# Altium project AutonomousVehicle_CurrentSense.PrjPcb
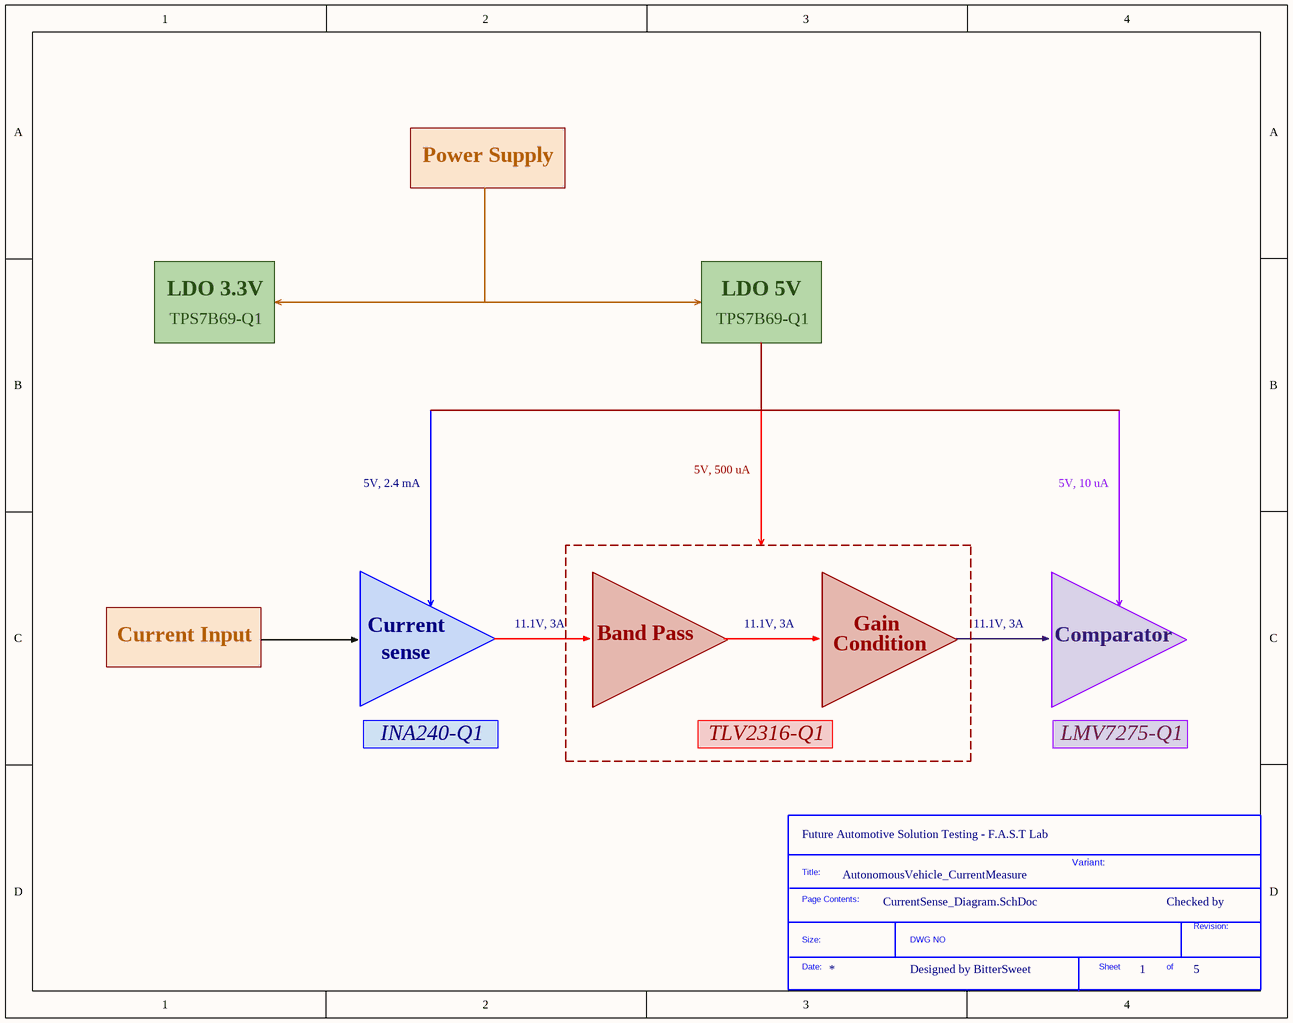
[diagram p0: CurrentSense_Diagram.SchDoc]
5 sheets, 72 parts. Net scope: flat (ports and power ports of the same name join across sheets).
Board file: AutonomousVehicle_CurrentSense.PcbDoc
Sheets:
  CurrentSense_Diagram.SchDoc
  CurrentSense_FileInfo.SchDoc
  CurrentSense_PowerDistribution.SchDoc
  CurrentSense_InputProcessing.SchDoc
  CurrentSense_ADCVoltage.SchDoc

## Sheet CurrentSense_Diagram.SchDoc
size A; SheetNumber: 1; SheetTotal: 5

### Parts
(Parts that share a designator on the sheet are numbered #1, #2 ... from top to bottom, then left to right.)
*?#1  SDTitleBlock  (value not drawn)  (graphical)

### Notes on the sheet
- Power Supply
- LDO 3.3V
- LDO 5V
- TPS7B69-Q1
- 5V, 2.4 mA
- 5V, 500 uA
- 5V, 10 uA
- Current
- 11.1V, 3A
- Band Pass
- Gain
- Current Input
- sense
- Condition
- Comparator
- INA240-Q1
- TLV2316-Q1
- LMV7275-Q1
- (near *?#1) Future Automotive Solution Testing - F.A.S.T Lab
- AutonomousVehicle_CurrentMeasure
- Variant:
- Checked by
- Designed by BitterSweet
- (in symbol SDTitleBlock) Title:; Page Contents:; Revision:; Size:; DWG NO; Date:; Sheet; of

## Sheet CurrentSense_FileInfo.SchDoc
size A; SheetNumber: 2; SheetTotal: 2

## Sheet CurrentSense_PowerDistribution.SchDoc
size A; SheetNumber: 3; SheetTotal: 5
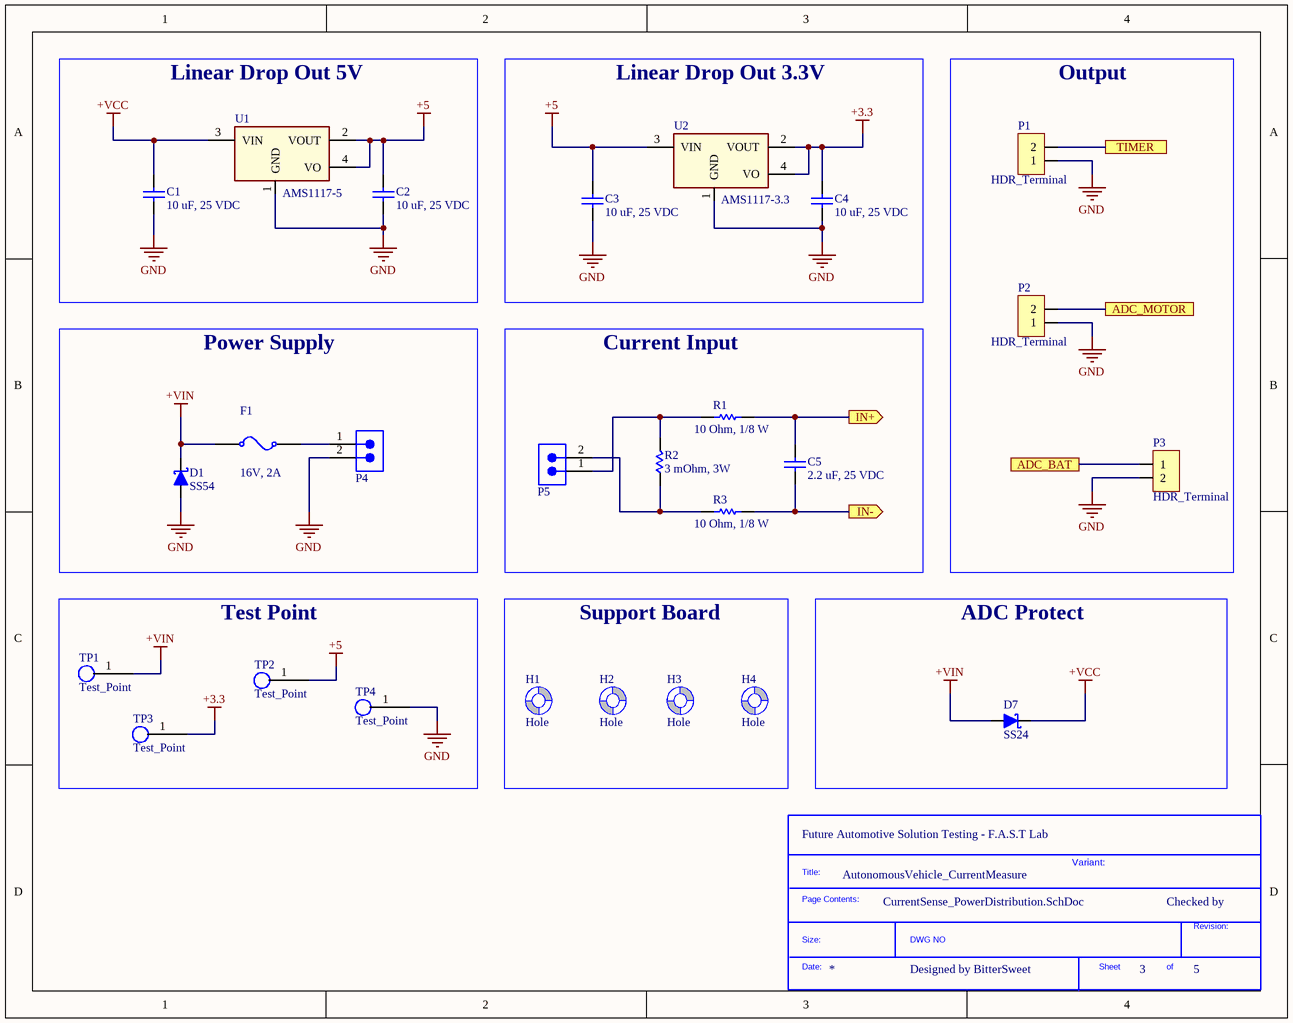
[diagram p1: CurrentSense_PowerDistribution.SchDoc]

### Parts
(Parts that share a designator on the sheet are numbered #1, #2 ... from top to bottom, then left to right.)
*?#2  SDTitleBlock  (value not drawn)  (graphical)
C1  10 uF, 25 VDC  [CAP_0603]
C2  10 uF, 25 VDC  [CAP_0603]
C3  10 uF, 25 VDC  [CAP_0603]
C4  10 uF, 25 VDC  [CAP_0603]
C5  2.2 uF, 25 VDC  [CAP_0805]
D1  SS54  [DO-214AB, SMA]
D7  SS24  [DO-214AB, SMA]
F1  16V, 2A  [Fuse_SMD_1812]
H1  Hole  [Hole_3.2mm]
H2  Hole  [Hole_3.2mm]
H3  Hole  [Hole_3.2mm]
H4  Hole  [Hole_3.2mm]
P1  HDR_Terminal  [HDR_Header_2.54]
P2  HDR_Terminal  [HDR_Header_2.54]
P3  HDR_Terminal  [HDR_Header_2.54]
P4  10A, 300V  [691322310002]  (value not drawn)
P5  10A, 300V  [691322310002]  (value not drawn)
R1  10 Ohm, 1/8 W  [RESISTOR_0805]
R2  3 mOhm, 3W  [RESISTOR-SMD-2512]
R3  10 Ohm, 1/8 W  [RESISTOR_0805]
TP1  Test_Point  [TP_1_5mm_SMD]
TP2  Test_Point  [TP_1_5mm_SMD]
TP3  Test_Point  [TP_1_5mm_SMD]
TP4  Test_Point  [TP_1_5mm_SMD]
U1  AMS1117-5  [AMS1117]
U2  AMS1117-3.3  [AMS1117]

### Blocks framed on the sheet
Linear Drop Out 5V: C1 C2 U1
Linear Drop Out 3.3V: C3 C4 U2
Output: P1-P3
Power Supply: D1 F1 P4
Current Input: C5 P5 R1-R3
Test Point: TP1-TP4
Support Board: H1-H4
ADC Protect: D7

### Ports
ADC_BAT, ADC_MOTOR, IN+ (out), IN- (out), TIMER

### Nets
+3.3: C4.2 TP3.1 U2.2(VOUT) U2.4(VO)
+5: C2.2 C3.2 TP2.1 U1.2(VOUT) U1.4(VO) U2.3(VIN)
+VCC: C1.2 D7.2(K) U1.3(VIN)
+VIN: D1.2(K) D7.1(A) F1.0 TP1.1
GND: C1.1 C2.1 C3.1 C4.1 D1.1(A) P1.1 P2.1 P3.2 P4.2 TP4.1 U1.1(GND) U2.1(GND)
NetC5_1: C5.1 R3.2 ; port IN-
NetC5_2: C5.2 R1.2 ; port IN+
NetC12_2: P1.2 ; port TIMER
NetC14_2: P2.2 ; port ADC_MOTOR
NetC15_2: P3.1 ; port ADC_BAT
NetF1_1: F1.1 P4.1
NetP5_1: P5.1 R1.1 R2.2
NetP5_2: P5.2 R2.1 R3.1

Not connected (* = marked no-connect by the designer): H1 1(Screw); H2 1(Screw); H3 1(Screw); H4 1(Screw)

### Notes on the sheet
- (near *?#2) Future Automotive Solution Testing - F.A.S.T Lab
- AutonomousVehicle_CurrentMeasure
- Variant:
- Checked by
- Designed by BitterSweet
- (in symbol SDTitleBlock) Title:; Page Contents:; Revision:; Size:; DWG NO; Date:; Sheet; of

### Library data of the parts
C1-C4 = 0106031061010: CAP, size 0603, 10 uF, 10 VDC; Manufacture Name: Samsung Electro-Mechanics; Manufacture SN: CL10A106KP8NNWC; Capacitance: 10 uF; Tolerance: +/-10%; Voltage Rating DC: 25 VDC; ComponentLink2Description: Datasheet; ComponentLink2URL: https://www.mouser.vn/datasheet/2/585/MLCC-1837944.pdf; Operating Temperature: -55 to +125degC; Packaging: Tape and Reel; Mounting Technology: SMT; Size: 0603; Supplier 1 Name: Mouser; Supplier 1 SN: 187-CL10A106KP8NNWC; Supplier 1 URL: https://www.mouser.vn/ProductDetail/Samsung-Electro-Mechanics/CL10A106KP8NNWC?qs=xZ%2FP%252Ba9zWqZx8LSX23YqWA%3D%3D&utm_source=mouser-refine-download&utm_medium=file&utm_campaign=CL10A106KP8NNWC&utm_content=Samsung-Electro-Mechanics; Supplier 2 Name: Digi-Key; Supplier 2 SN: 1276-CL10A106KP8NNWCTR-ND; Supplier 2 URL: https://www.digikey.com/en/products/detail/samsung-electro-mechanics/cl10a106kp8nnwc/16572907; Supplier 3 Name: thegioiic; Supplier 3 SN: N/A; Supplier 3 URL: https://www.thegioiic.com/tu-gom-0603-10uf-25v; Value: 10 uF, 25 VDC
C5 = 0108052251025: CAP, size 0805, 2.2 uF, 25 VDC; Manufacture Name: TDK; Manufacture SN: CGA4J3X7R1E225K125AD; Capacitance: 2.2 uF; Tolerance: +/-10%; Voltage Rating DC: 25 VDC; ComponentLink2Description: Datasheet; ComponentLink2URL: https://product.tdk.com/system/files/dam/doc/product/capacitor/ceramic/mlcc/catalog/mlcc_automotive_epoxy_en.pdf?ref_disty=mouser; Operating Temperature: -55 to +125degC; Packaging: Tape and Reel; Mounting Technology: SMT; Size: 0805; Supplier 1 Name: Mouser; Supplier 1 SN: 810-CGA4J3X7R1E225KD; Supplier 1 URL: https://www.mouser.vn/ProductDetail/TDK/CGA4J3X7R1E225K125AD?qs=xLDY6iXSiQZ6drRfaPQTzQ%3D%3D&utm_source=mouser-refine-download&utm_medium=file&utm_campaign=CGA4J3X7R1E225K125AD&utm_content=TDK; Supplier 2 Name: Digi-Key; Supplier 2 SN: 445-9923-2-ND; Supplier 2 URL: https://www.digikey.com/en/products/detail/tdk-corporation/cga4j3x7r1e225k125ad/3933656; Supplier 3 Name: thegioiic; Supplier 3 SN: OEM; Supplier 3 URL: https://www.thegioiic.com/tu-gom-0805-2-2uf-25v; Value: 2.2 uF, 25 VDC
D1 D7 = Diode_Schottky: SS54 SMC Diode Schottky 5A 40V
F1 = 061812200016: Resettable Fuse, Size 1812, 16V, 2A; Manufacturer: Littelfuse; Threshold Current: 40A; Trip Current: 4A; Threshold Voltage: 16V; Hold Current: 2A; Size: 1812; Mounting Technology: SMT/SMD; ComponentLink1Description: Datasheet link; ComponentLink1URL: https://www.littelfuse.com/~/media/electronics/product_specifications/resettable_ptcs/littelfuse_ptc_minismdc300f_2_product_specification.pdf.pdf; ComponentLink2Description: Supplier 1 URL; ComponentLink2URL: https://www.mouser.vn/ProductDetail/Littelfuse/MINISMDC200F-16-2?qs=pBN%2FbMTRZdcH0yqkqvkPxw%3D%3D; ComponentLink3Description: Supplier 2 URL; ComponentLink3URL: https://www.digikey.com/en/products/detail/littelfuse-inc/MINISMDC200F-16-2/6348163?s=N4IgTCBcDaILIEkByCDKcAiBhMAGXAYgPQCMAbALQQC6AvkA; ComponentLink4Description: Supplier 3 URL; ComponentLink4URL: https://www.thegioiic.com/cau-chi-tu-phuc-hoi-1812-16v-2a; Supplier 1 Name: Mouser; Supplier 1 SN: 650-MINISMDC200F/162; Supplier 1 URL: https://www.mouser.vn/ProductDetail/Littelfuse/MINISMDC200F-16-2?qs=pBN%2FbMTRZdcH0yqkqvkPxw%3D%3D; Supplier 2 Name: Digi-Key; Supplier 2 SN: MINISMDC200F/16-2TR-ND; Supplier 2 URL: https://www.mouser.vn/ProductDetail/Littelfuse/MINISMDC200F-16-2?qs=pBN%2FbMTRZdcH0yqkqvkPxw%3D%3D; Supplier 3 Name: thegioiic; Supplier 3 SN: N/A; Supplier 3 URL: https://www.thegioiic.com/cau-chi-tu-phuc-hoi-1812-16v-2a; Value: 16V, 2A
P1-P3 = HDR_Terminal: HDR_Terminal 2 pin; Supplier: ThegioiIC; ComponentLink1Description: URL; ComponentLink1URL: https://www.thegioiic.com/kf128-2-v-domino-2-chan-thang-3-5mm-300v-10a-han-pcb
P4 P5 = 691322310002: WR-TBL Series 322 Horizontal PCB Header, THT, pitch 3.81mm, 2p; Manufacturer: Wurth Elektronik; Modularity: No; ComponentLink1Description: Datasheet Link; ComponentLink1URL: https://www.we-online.com/redexpert/spec/691322310002?ad; ComponentLink2Description: Supplier 1 URL; ComponentLink2URL: N/A; Manufacturer Part Number: 691322310002; Category: Terminal Blocks; Match Code: WR-TBL; Mount: Through Hole; Operating Temperature Max: 105°C; Operating Temperature Min: -40°C; Packaging: Box; Application: Pluggable; Number of Pins: 2; Number of Rows: 1; Orientation: Horizontal; Pitch: 3.81mm; Rated Current: 10A; Working Voltage: 300V; ComponentLink3Description: Supplier 2 URL; ComponentLink3URL: N/A; ComponentLink4Description: Supplier 3 URL; ComponentLink4URL: https://www.thegioiic.com/kf-3-81-2-r-terminal-block-plug-in-han-pcb-2-chan-cong-3-81mm-300v-10a; Supplier 1 Name: Mouser; Supplier 1 SN: N/A; Supplier 1 URL: N/A; Supplier 2 Name: Digi-Key; Supplier 2 SN: N/A; Supplier 2 URL: N/A; Supplier 3 Name: thegioiic; Supplier 3 SN: N/A; Supplier 3 URL: https://www.thegioiic.com/kf-3-81-2-r-terminal-block-plug-in-han-pcb-2-chan-cong-3-81mm-300v-10a; Value: 10A, 300V
R1 R3 = 0008051001: RES, size 0805, 10 Ohm, 1/8 W; Manufacture  Name: Vishay Dale Thin Film; Manufacture  SN: M55342H06B10D0RT5; Resistance tolerance: +/-1%; Rated Power: 1/8 W; Resistance: 10 Ohm; Size: 0805; Mounting Technology: SMT; Supplier 1 Name: Mouser; Supplier 1 SN: 71-CRCW080510R0FKEAH; Supplier 1 URL: https://www.mouser.vn/ProductDetail/Vishay-Dale/CRCW080510R0FKEAHP?qs=sGAEpiMZZMtlubZbdhIBIB2QTI7Ai3Wq221SUXRDybo%3D; Supplier 2 Name: Digi-Key; Supplier 2 SN: 764-M55342H06B10D0RT5TR-ND; Supplier 2 URL: https://www.digikey.com/en/products/detail/vishay-dale-thin-film/M55342H06B10D0RT5/3580812; Supplier 3 Name: Thegioiic; Supplier 3 SN: N/A; Supplier 3 URL: https://www.thegioiic.com/dien-tro-10-ohm-0805-1-; Value: 10 Ohm, 1/8 W; ComponentLink1Description: Datasheet link; ComponentLink1URL: https://www.vishay.com/docs/60018/eh.pdf; ComponentLink2Description: Supplier 1 URL; ComponentLink2URL: https://www.mouser.vn/ProductDetail/Vishay-Dale/CRCW080510R0FKEAHP?qs=sGAEpiMZZMtlubZbdhIBIB2QTI7Ai3Wq221SUXRDybo%3D; ComponentLink3Description: Supplier 2 URL; ComponentLink3URL: https://www.digikey.com/en/products/detail/vishay-dale-thin-film/M55342H06B10D0RT5/3580812; ComponentLink4Description: Supplier 3 URL; ComponentLink4URL: https://www.thegioiic.com/dien-tro-10-ohm-0805-1-
R2 = RESISTOR: MP: NUCLEO-F401RE; Availability: Unavailable; Price: None; Package: None; Value: *; Mouser Link: https://www.mouser.vn/ProductDetail/Bourns/CRE2512-FZ-R003E-3?qs=rpfKl3ntHzPjkfGuk%252BIwsA%3D%3D&srsltid=AfmBOopEgYGycx6kmbnZ21OC9P-p9XnaYC4Ly7xv01NJ0SqXpV2qtA37; Mouser Part: 652-CRE2512FZR003E-3
U1 U2 = AMS1117: IC Linear Drop Out 3.3V 1A SOT-223
  U1: URL: https://www.thegioiic.com/xblw-ams1117-5-0v-ic-on-ap-5v-1a-sot-223
  U2: URL: https://www.thegioiic.com/ams1117-3-3v-ic-on-ap-3-3v-1a-sot-223

## Sheet CurrentSense_InputProcessing.SchDoc
size A; SheetNumber: 4; SheetTotal: 5
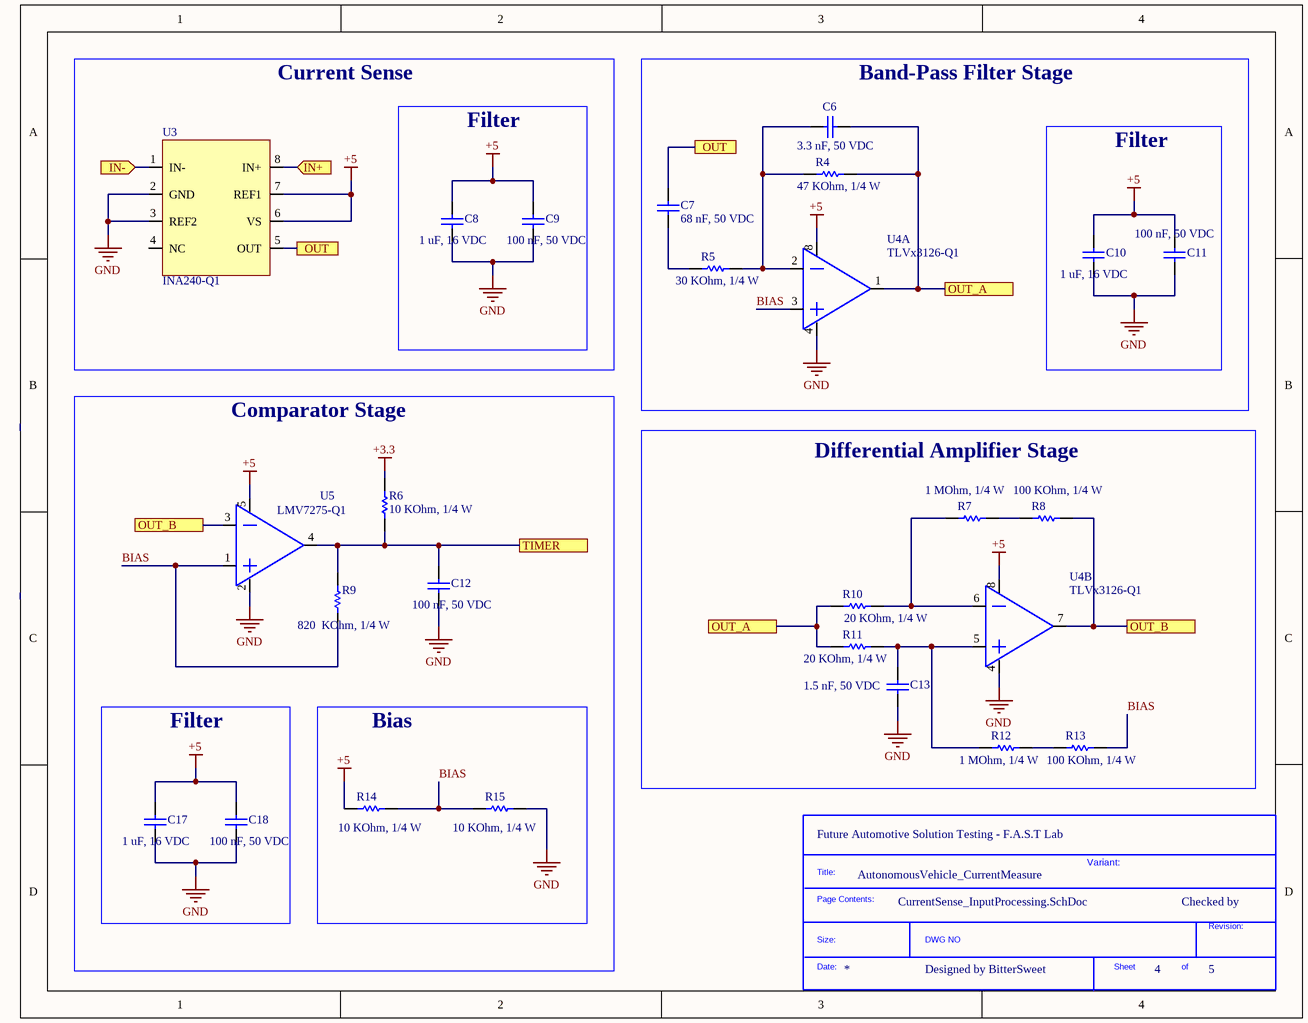
[diagram p2: CurrentSense_InputProcessing.SchDoc]

### Parts
(Parts that share a designator on the sheet are numbered #1, #2 ... from top to bottom, then left to right.)
*?#3  SDTitleBlock  (value not drawn)  (graphical)
C6  3.3 nF, 50 VDC  [CAP_0603]
C7  68 nF, 50 VDC  [CAP_0603]
C8  1 uF, 16 VDC  [CAP_0603]
C9  100 nF, 50 VDC  [CAP_0603]
C10  1 uF, 16 VDC  [CAP_0603]
C11  100 nF, 50 VDC  [CAP_0603]
C12  100 nF, 50 VDC  [CAP_0603]
C13  1.5 nF, 50 VDC  [CAP_0603]
C17  1 uF, 16 VDC  [CAP_0603]
C18  100 nF, 50 VDC  [CAP_0603]
R4  47 KOhm, 1/4 W  [resistor_0603]
R5  30 KOhm, 1/4 W  [resistor_0603]
R6  10 KOhm, 1/4 W  [resistor_0603]
R7  1 MOhm, 1/4 W  [resistor_0603]
R8  100 KOhm, 1/4 W  [resistor_0603]
R9  820  KOhm, 1/4 W  [resistor_0603]
R10  20 KOhm, 1/4 W  [resistor_0603]
R11  20 KOhm, 1/4 W  [resistor_0603]
R12  1 MOhm, 1/4 W  [resistor_0603]
R13  100 KOhm, 1/4 W  [resistor_0603]
R14  10 KOhm, 1/4 W  [resistor_0603]
R15  10 KOhm, 1/4 W  [resistor_0603]
U3  INA240-Q1  [INA240-Q1-SOIC-8]
U4  TLVx3126-Q1  [TLVx316-Q1-VSSOP8]  (parts A,B of 2)
U5  LMV7275-Q1  [LMV7275-Q1]

### Blocks framed on the sheet
Current Sense: U3
Band-Pass Filter Stage: C6 C7 R4 R5 U4
Filter: C8 C9
Filter: C10 C11
Comparator Stage: C12 R6 R9 U5
Differential Amplifier Stage: C13 R7 R8 R10-R13 U4
Filter: C17 C18
Bias: R14 R15

### Ports
IN+ (in), IN- (in), OUT, OUT_A, OUT_B, TIMER

### Nets
+3.3: R6.2
+5: C8.2 C9.2 C10.2 C11.2 C17.2 C18.2 R14.2 U3.6(VS) U3.7(REF1) U4.8(VCC) U5.5(V+)
GND: C8.1 C9.1 C10.1 C11.1 C12.1 C13.1 C17.1 C18.1 R15.1 U3.2(GND) U3.3(REF2) U4.4(GND) U5.2(V-)
BIAS: R9.1 R13.2 R14.1 R15.2 U4.3(INA+) U5.1(IN+)
NetC5_1: U3.1(IN-) ; port IN-
NetC5_2: U3.8(IN+) ; port IN+
NetC6_1: C6.1 R4.1 R5.2 U4.2(INA-)
NetC6_2: C6.2 R4.2 R10.1 R11.1 U4.1(OUTA) ; port OUT_A
NetC7_1: C7.1 R5.1
NetC7_2: C7.2 U3.5(OUT) ; port OUT
NetC12_2: C12.2 R6.1 R9.2 U5.4(OUT) ; port TIMER
NetC13_2: C13.2 R11.2 R12.1 U4.5(INB+)
NetP6_2: R8.2 U4.7(OUTB) U5.3(IN-) ; port OUT_B
NetR7_1: R7.1 R10.2 U4.6(INB-)
NetR7_2: R7.2 R8.1
NetR12_2: R12.2 R13.1

Not connected (* = marked no-connect by the designer): U3 4(NC)

### Notes on the sheet
- (near *?#3) Future Automotive Solution Testing - F.A.S.T Lab
- AutonomousVehicle_CurrentMeasure
- Variant:
- Checked by
- Designed by BitterSweet
- (in symbol SDTitleBlock) Title:; Page Contents:; Revision:; Size:; DWG NO; Date:; Sheet; of

### Library data of the parts
C6 = 0106033320550: CAP, size 0603, 3.3 nF, 50 VDC; Manufacture Name: TDK; Manufacture SN: CGA3E2C0G1H332J080AE; Capacitance: 3.3 nF; Tolerance: +/-5%; Voltage Rating DC: 50 VDC; ComponentLink2Description: Datasheet; ComponentLink2URL: https://product.tdk.com/system/files/dam/doc/product/capacitor/ceramic/mlcc/catalog/mlcc_automotive_soft_en.pdf?ref_disty=mouser; Operating Temperature: -55 to +125degC; Packaging: Tape and Reel; Mounting Technology: SMT; Size: 0603; Supplier 1 Name: Mouser; Supplier 1 SN: 810-CGA3E2C0G1H332J8; Supplier 1 URL: https://www.mouser.com/ProductDetail/TDK/CGA3E2C0G1H332J080AE?qs=P1JMDcb91o59%252BuVOytSHFw%3D%3D&utm_source=mouser-refine-download&utm_medium=file&utm_campaign=CGA3E2C0G1H332J080AE&utm_content=TDK; Supplier 2 Name: Digi-Key; Supplier 2 SN: 445-CGA3E2C0G1H332J080AETR-ND; Supplier 2 URL: https://www.digikey.com/en/products/detail/tdk-corporation/cga3e2c0g1h332j080ae/11697916; Supplier 3 Name: thegioiic; Supplier 3 SN: N/A; Supplier 3 URL: https://www.thegioiic.com/tu-gom-0603-3-3nf-50v; Value: 3.3 nF, 50 VDC
C7 = 0106036831050: CAP, size 0603, 68 nF, 50 VDC; Manufacture Name: TDK; Manufacture SN: CGA3E2X7R1H683K080AA; Capacitance: 68 nF; Tolerance: +/-10%; Voltage Rating DC: 50 VDC; ComponentLink2Description: Datasheet; ComponentLink2URL: https://product.tdk.com/system/files/dam/doc/product/capacitor/ceramic/mlcc/catalog/mlcc_automotive_general_en.pdf?ref_disty=mouser; Operating Temperature: -55 to +125degC; Packaging: Tape and Reel; Mounting Technology: SMT; Size: 0603; Supplier 1 Name: Mouser; Supplier 1 SN: 810-CGA3E2X7R1H683K; Supplier 1 URL: https://www.mouser.com/ProductDetail/TDK/CGA3E2X7R1H683K080AA?qs=NRhsANhppD%252BWyOHUcAY%252Bxg%3D%3D&utm_source=mouser-refine-download&utm_medium=file&utm_campaign=CGA3E2X7R1H683K080AA&utm_content=TDK; Supplier 2 Name: Digi-Key; Supplier 2 SN: 445-5665-2-ND; Supplier 2 URL: https://www.digikey.com/en/products/detail/tdk-corporation/cga3e2x7r1h683k080aa/2443143; Supplier 3 Name: thegioiic; Supplier 3 SN: N/A; Supplier 3 URL: https://www.thegioiic.com/tu-gom-0603-68nf-50v; Value: 68 nF, 50 VDC
C8 C10 C17 = 0106031051016: CAP, size 0603, 1 uF, 16 VDC; Manufacture Name: Samsung Electro-Mechanics; Manufacture SN: CL10B105KO8NNWC; Capacitance: 1 uF; Tolerance: +/-10%; Voltage Rating DC: 16 VDC; ComponentLink2Description: Datasheet; ComponentLink2URL: https://www.mouser.vn/datasheet/2/585/Samsung_MLCC_1837944-1929650.pdf; Operating Temperature: -55 to +125degC; Packaging: Tape and Reel; Mounting Technology: SMT; Size: 0603; Supplier 1 Name: Mouser; Supplier 1 SN: 187-CL10B105KO8NNWC; Supplier 1 URL: https://www.mouser.vn/ProductDetail/Samsung-Electro-Mechanics/CL10B105KO8NNWC?qs=81r%252BiQLm7BT%252BXtc72qn1ug%3D%3D&utm_source=mouser-refine-download&utm_medium=file&utm_campaign=CL10B105KO8NNWC&utm_content=Samsung-Electro-Mechanics; Supplier 2 Name: Digi-Key; Supplier 2 SN: 1276-CL10B105KO8NNWCTR-ND; Supplier 2 URL: https://www.digikey.com/en/products/detail/samsung-electro-mechanics/cl10b105ko8nnwc/16572783; Supplier 3 Name: thegioiic; Supplier 3 SN: N/A; Supplier 3 URL: https://www.thegioiic.com/tu-gom-0603-1uf-16v; Value: 1 uF, 16 VDC
C9 C11 C12 C18 = 0106031041050: CAP, size 0603, 100 nF, 50 VDC; Manufacture Name: TDK; Manufacture SN: CGA3E3X8R1H104K080AE; Capacitance: 100 nF; Tolerance: +/-10%; Voltage Rating DC: 50 VDC; ComponentLink2Description: Datasheet; ComponentLink2URL: https://product.tdk.com/system/files/dam/doc/product/capacitor/ceramic/mlcc/catalog/mlcc_automotive_soft_en.pdf?ref_disty=mouser; Operating Temperature: -55 to +125degC; Packaging: Tape and Reel; Mounting Technology: SMT; Size: 0603; Supplier 1 Name: Mouser; Supplier 1 SN: 810-CGA3E3X8R1H104KA; Supplier 1 URL: https://www.mouser.com/ProductDetail/TDK/CGA3E3X8R1H104K080AE?qs=nQSIdc08i%252Bd8g3IRRgU2bw%3D%3D&utm_source=mouser-refine-download&utm_medium=file&utm_campaign=CGA3E3X8R1H104K080AE&utm_content=TDK; Supplier 2 Name: Digi-Key; Supplier 2 SN: 445-173697-2-ND; Supplier 2 URL: https://www.digikey.com/en/products/detail/tdk-corporation/cga3e3x8r1h104k080ae/5809262; Supplier 3 Name: thegioiic; Supplier 3 SN: N/A; Supplier 3 URL: N/Ahttps://www.thegioiic.com/tu-gom-0603-100nf-0-1uf-50v; Value: 100 nF, 50 VDC
C13 = 0106031521050: CAP, size 0603, 1.5 nF, 50 VDC; Manufacture Name: TDK; Manufacture SN: CGA3E2X7R1H152K080AA; Capacitance: 1.5 nF; Tolerance: +/-10%; Voltage Rating DC: 50 VDC; ComponentLink2Description: Datasheet; ComponentLink2URL: https://product.tdk.com/system/files/dam/doc/product/capacitor/ceramic/mlcc/catalog/mlcc_automotive_general_en.pdf?ref_disty=mouser; Operating Temperature: -55 to +125degC; Packaging: Tape and Reel; Mounting Technology: SMT; Size: 0603; Supplier 1 Name: Mouser; Supplier 1 SN: 810-CGA3E2X7R1H152K; Supplier 1 URL: https://www.mouser.com/ProductDetail/TDK/CGA3E2X7R1H152K080AA?qs=NRhsANhppD%2FNdlvuo0XOnQ%3D%3D&utm_source=mouser-refine-download&utm_medium=file&utm_campaign=CGA3E2X7R1H152K080AA&utm_content=TDK; Supplier 2 Name: Digi-Key; Supplier 2 SN: 445-6920-2-ND; Supplier 2 URL: https://www.digikey.com/en/products/detail/tdk-corporation/cga3e2x7r1h152k080aa/2672813; Supplier 3 Name: thegioiic; Supplier 3 SN: N/A; Supplier 3 URL: https://www.thegioiic.com/tu-gom-0603-1-5nf-50v; Value: 1.5 nF, 50 VDC
R4 = 0006034701: RES, size 0603, 47 Ohm, 1/4 W; Manufacture  Name: OEM; Rated Power: 1/4 W; Resistance: 47 KOhm; Resistance Tolerance: +/-1%; Size: 0603; Mounting Technology: SMT; Supplier 1 Name: Mouser; Supplier 1 SN: 667-ERJ-UP3F47R0V; Supplier 1 URL: https://www.mouser.vn/ProductDetail/Panasonic/ERJ-UP3F47R0V?qs=GedFDFLaBXE9d1Rnv%2Fokmg%3D%3D; Supplier 2 Name: Digi-Key; Supplier 2 SN: 10-ERJ-UP3F47R0VTR-ND - Tape & Reel (TR); Supplier 3 Name: thegioiic; Supplier 3 SN: N/A; Supplier 3 URL: https://www.thegioiic.com/dien-tro-47-kohm-0603-1-; Manufacture  SN: OEM; Value: 47 KOhm, 1/4 W; ComponentLink1Description: Datasheet link; ComponentLink1URL: https://www.mouser.vn/datasheet/2/315/Panasonic_Resistors_Thick_Film_Anti_Sulf_Anti_Surg-1825099.pdf; ComponentLink2Description: Supplier 1 URL; ComponentLink2URL: N/A; ComponentLink3Description: Supplier 2 URL; ComponentLink3URL: https://www.digikey.com/en/products/detail/panasonic-electronic-components/ERJ-UP3F47R0V/12092512?s=N4IgTCBcDaIGxwOwFoCiAlAUsgqgBQGYAxAFkXQAYA1EAXQF8g; ComponentLink4Description: Supplier 3 URL; ComponentLink4URL: N/A; Supplier 2 URL: https://www.digikey.com/en/products/detail/panasonic-electronic-components/ERJ-UP3F47R0V/12092512?s=N4IgTCBcDaIGxwOwFoCiAlAUsgqgBQGYAxAFkXQAYA1EAXQF8g
R5 = 0006032345: RES, size 0603, 230 KOhm, 1/4 W; Manufacture  Name: OEM; Rated Power: 1/4 W; Resistance Tolerance: +/-1%; Size: 0603; Mounting Technology: SMT; Resistance: 230 KOhm; Supplier 1 Name: Mouser; Supplier 1 SN: N/A; Supplier 1 URL: N/A; Supplier 2 Name: Digi-Key; Supplier 2 SN: N/A; Supplier 3 Name: thegioiic; Supplier 3 SN: N/A; Supplier 3 URL: https://www.thegioiic.com/dien-tro-30-kohm-0603-1-; Manufacture  SN: OEM; Value: 30 KOhm, 1/4 W; ComponentLink1Description: Datasheet link; ComponentLink1URL: N/A; ComponentLink2Description: Supplier 1 URL; ComponentLink2URL: N/A; ComponentLink3Description: Supplier 2 URL; ComponentLink3URL: N/A; ComponentLink4Description: Supplier 3 URL; ComponentLink4URL: N/A; Supplier 2 URL: N/A
R6 R14 R15 = 0006031031: RES, size 0603, 10 KOhm, 1/4 W; Manufacture  Name: OEM; Resistance: 10 KOhm; Rated Power: 1/4 W; Resistance Tolerance: +/-1%; Size: 0603; Mounting Technology: SMT; Supplier 1 Name: Mouser; Supplier 1 SN: 755-ESR03EZPF1002; Supplier 2 Name: Digi-Key; Supplier 2 SN: RHM10KADTR-ND RHM10KADCT-ND RHM10KADDKR-ND; Supplier 1 URL: https://www.mouser.vn/ProductDetail/ROHM-Semiconductor/ESR03EZPF1002?qs=sGAEpiMZZMvdGkrng054t67Efho1F8r6CDeAsqwFse8%3D; Supplier 3 Name: thegioiic; Supplier 3 SN: N/A; Supplier 3 URL: https://www.thegioiic.com/dien-tro-10-kohm-0603-1-; Manufacture  SN: OEM; Value: 10 KOhm, 1/4 W; ComponentLink1Description: Datasheet link; ComponentLink1URL: https://fscdn.rohm.com/en/products/databook/datasheet/passive/resistor/chip_resistor/esr-e.pdf; ComponentLink2Description: Supplier 1 URL; ComponentLink2URL: N/A; ComponentLink3Description: Supplier 2 URL; ComponentLink3URL: https://www.digikey.com/en/products/detail/rohm-semiconductor/ESR03EZPF1002/1983429; ComponentLink4Description: Supplier 3 URL; ComponentLink4URL: N/A; Supplier 2 URL: https://www.digikey.com/en/products/detail/rohm-semiconductor/ESR03EZPF1002/1983429
R7 R12 = 0006031051: RES, size 0603, 1 MOhm, 1/4 W; Manufacture  Name: OEM; Resistance: 1 MOhm; Rated Power: 1/4 W; Resistance Tolerance: +/-1%; Size: 0603; Mounting Technology: SMT; Supplier 1 Name: Mouser; Supplier 1 SN: 71-RCS06031M00FKEA; Supplier 2 Name: Digi-Key; Supplier 2 SN: 541-2803-2-ND 541-2803-1-ND 541-2803-6-ND; Supplier 1 URL: https://www.mouser.vn/ProductDetail/Vishay-Dale/RCS06031M00FKEA?qs=sGAEpiMZZMvdGkrng054t9clqp6gtJJdWojIF5doOmwdMUlAJJ6Dlw%3D%3D; Supplier 3 Name: thegioiic; Supplier 3 SN: N/A; Supplier 3 URL: https://www.thegioiic.com/dien-tro-1-mohm-0603-1-; Manufacture  SN: OEM; Value: 1 MOhm, 1/4 W; ComponentLink1Description: Datasheet link; ComponentLink1URL: https://www.vishay.com/docs/20065/rcse3.pdf; ComponentLink2Description: Supplier 1 URL; ComponentLink2URL: N/A; ComponentLink3Description: Supplier 2 URL; ComponentLink3URL: https://www.digikey.com/en/products/detail/vishay-dale/RCS06031M00FKEA/5866949; ComponentLink4Description: Supplier 3 URL; ComponentLink4URL: N/A; Supplier 2 URL: https://www.digikey.com/en/products/detail/vishay-dale/RCS06031M00FKEA/5866949
R8 R13 = 0006031041: RES, size 0603, 100 KOhm, 1/4 W; Manufacture  Name: OEM; Rated Power: 1/4 W; Resistance Tolerance: +/-1%; Resistance: 100 KOhm; Size: 0603; Mounting Technology: SMT; Supplier 1 Name: Mouser; Supplier 1 SN: 603-SR0603FR-7T100KL; Supplier 2 Name: Digi-Key; Supplier 2 SN: YAG5821TR-ND YAG5821CT-ND YAG5821DKR-ND; Supplier 1 URL: https://www.mouser.vn/ProductDetail/YAGEO/SR0603FR-7T100KL?qs=sGAEpiMZZMvdGkrng054tz1y1XEHv7sNa%252BA%2F4WiDMf7aGw4zRBb%2FFQ%3D%3D; Supplier 3 Name: thegioiic; Supplier 3 SN: N/A; Supplier 3 URL: https://www.thegioiic.com/dien-tro-100-kohm-0603-1-; Manufacture  SN: OEM; Value: 100 KOhm, 1/4 W; ComponentLink1Description: Datasheet link; ComponentLink1URL: https://www.yageo.com/upload/media/product/productsearch/datasheet/rchip/PYu-SR_20105_RoHS_L_10.pdf; ComponentLink2Description: Supplier 1 URL; ComponentLink2URL: N/A; ComponentLink3Description: Supplier 2 URL; ComponentLink3URL: https://www.digikey.com/en/products/detail/yageo/SR0603FR-7T100KL/9373095; ComponentLink4Description: Supplier 3 URL; ComponentLink4URL: N/A; Supplier 2 URL: https://www.digikey.com/en/products/detail/yageo/SR0603FR-7T100KL/9373095
R9 = 0006038251: RES, size 0603, 820  KOhm, 1/4 W; Manufacture  Name: OEM; Rated Power: 1/4 W; Resistance Tolerance: +/-1%; Size: 0603; Mounting Technology: SMT; Resistance: 820  KOhm; Supplier 1 Name: Mouser; Supplier 1 SN: 660-HV731JTTD8204F; Supplier 1 URL: https://www.mouser.vn/ProductDetail/KOA-Speer/HV731JTTD8204F?qs=ZqVPfSd1khqN0teaqWW7DA%3D%3D; Supplier 2 Name: Digi-Key; Supplier 2 SN: 13-RC0603FR-078M2LTR-ND; Supplier 3 Name: thegioiic; Supplier 3 SN: N/A; Supplier 3 URL: https://www.thegioiic.com/product/dien-tro-dan-smd?prid=6628,4725; Manufacture  SN: OEM; Value: 820  KOhm, 1/4 W; ComponentLink1Description: Datasheet link; ComponentLink1URL: N/A; ComponentLink2Description: Supplier 1 URL; ComponentLink2URL: N/A; ComponentLink3Description: Supplier 2 URL; ComponentLink3URL: https://www.digikey.com/en/products/detail/yageo/RC0603FR-078M2L/5918418; ComponentLink4Description: Supplier 3 URL; ComponentLink4URL: N/A; Supplier 2 URL: https://www.digikey.com/en/products/detail/yageo/RC0603FR-078M2L/5918418
R10 R11 = 0006032035: RES, size 0603, 20 KOhm, 1/4 W; Manufacture  Name: Panasonic; Manufacture  SN: ERJ-UP3J203V; Rated Power: 1/4 W; Resistance: 20 KOhm; Resistance Tolerance: +/-5%; Size: 0603; Mounting Technology: SMT; Supplier 1 Name: Mouser; Supplier 1 SN: 667-ERJ-UP3J203V; Supplier 1 URL: https://www.mouser.vn/datasheet/2/315/Panasonic_Resistors_Thick_Film_Anti_Sulf_Anti_Surg-1825099.pdf; Supplier 2 Name: Digi-Key; Supplier 2 SN: 10-ERJ-UP3J203VTR-ND - Tape & Reel (TR); Supplier 3 Name: thegioiic; Supplier 3 SN: N/A; Supplier 3 URL: https://www.thegioiic.com/dien-tro-20-kohm-0603-1-; Value: 20 KOhm, 1/4 W; ComponentLink1Description: Datasheet link; ComponentLink1URL: https://www.mouser.vn/datasheet/2/315/Panasonic_Resistors_Thick_Film_Anti_Sulf_Anti_Surg-1825099.pdf; ComponentLink2Description: Supplier 1 URL; ComponentLink2URL: N/A; ComponentLink3Description: Supplier 2 URL; ComponentLink3URL: https://www.digikey.com/en/products/detail/panasonic-electronic-components/ERJ-UP3J203V/12092736?s=N4IgTCBcDaIGxwOwFoCiAlAUsgqgBQGZMwAGAgNRAF0BfIA; ComponentLink4Description: Supplier 3 URL; ComponentLink4URL: N/A; Supplier 2 URL: https://www.digikey.com/en/products/detail/panasonic-electronic-components/ERJ-UP3J203V/12092736?s=N4IgTCBcDaIGxwOwFoCiAlAUsgqgBQGZMwAGAgNRAF0BfIA
U3 = INA240-Q1: INA240-Q1 AEC-Q100, –4-V to 80-V, Bidirectional, Ultra-Precise Current Sense Amplifier With Enhanced PWM Rejection
U4 = TLVx3126-Q1: TLVx316-Q1 10-MHz, Rail-to-Rail Input/Output, Low-Voltage, 1.8-V CMOS Operational Amplifiers
U5 = LMV7275-Q1: LMV7275-Q1 Automotive Single 1.8-V Low Power Comparator With Rail-to-Rail Input. SC-70 package.

## Sheet CurrentSense_ADCVoltage.SchDoc
size A; SheetNumber: 5; SheetTotal: 5
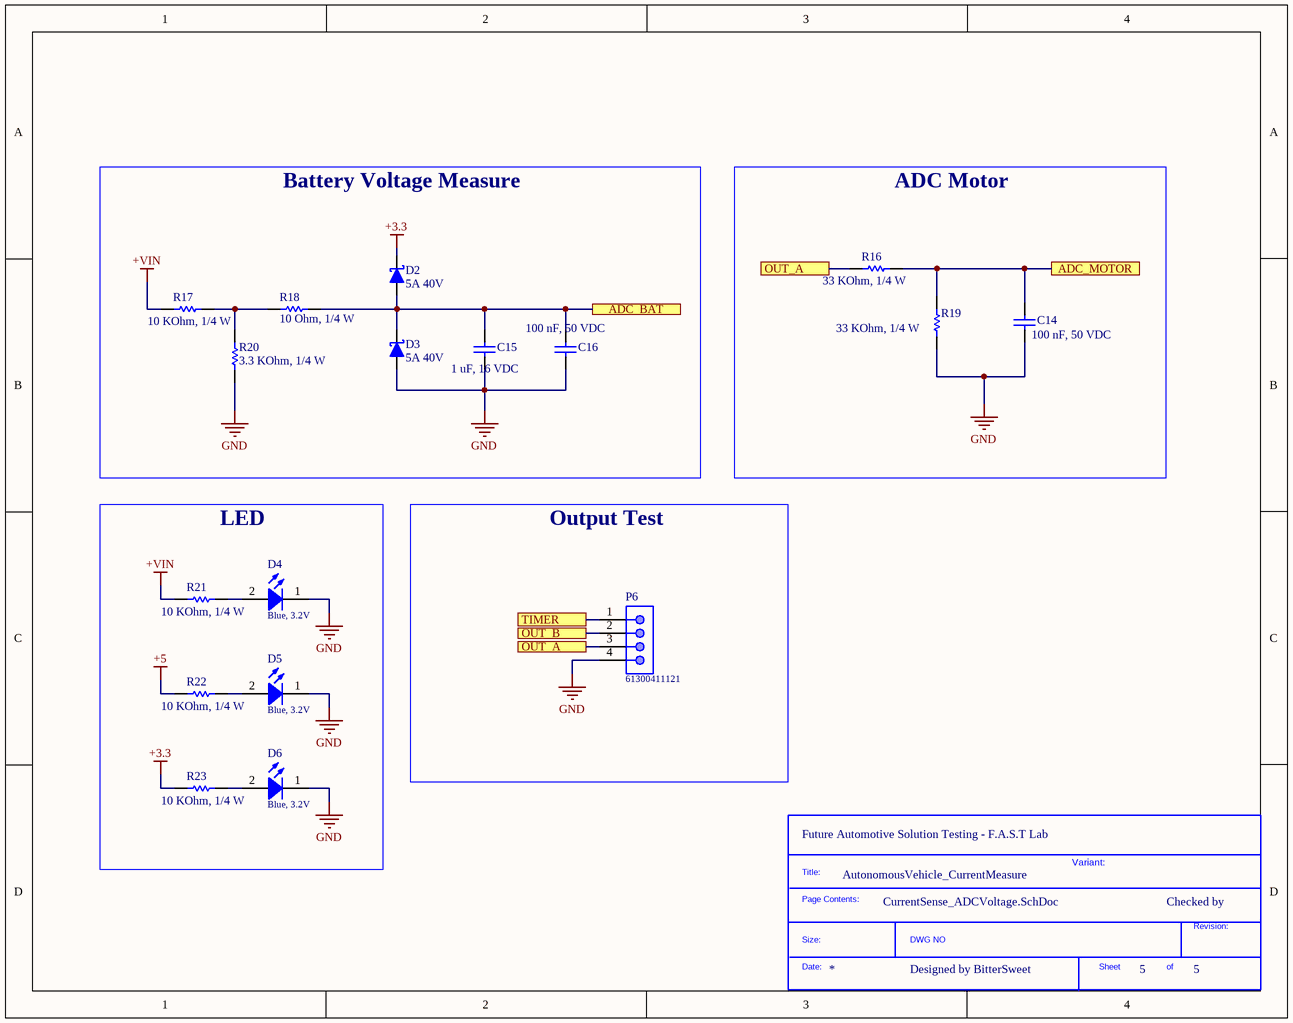
[diagram p3: CurrentSense_ADCVoltage.SchDoc]

### Parts
(Parts that share a designator on the sheet are numbered #1, #2 ... from top to bottom, then left to right.)
*?#4  SDTitleBlock  (value not drawn)  (graphical)
C14  100 nF, 50 VDC  [CAP_0603]
C15  1 uF, 16 VDC  [CAP_0603]
C16  100 nF, 50 VDC  [CAP_0603]
D2  5A 40V  [DO-214AB, SMA]
D3  5A 40V  [DO-214AB, SMA]
D4  Blue, 3.2V  [WL-SMCW_0603_H=0.7mm]
D5  Blue, 3.2V  [WL-SMCW_0603_H=0.7mm]
D6  Blue, 3.2V  [WL-SMCW_0603_H=0.7mm]
P6  61300411121  [61300411121]
R16  33 KOhm, 1/4 W  [resistor_0603]
R17  10 KOhm, 1/4 W  [resistor_0603]
R18  10 Ohm, 1/4 W  [resistor_0603]
R19  33 KOhm, 1/4 W  [resistor_0603]
R20  3.3 KOhm, 1/4 W  [resistor_0603]
R21  10 KOhm, 1/4 W  [resistor_0603]
R22  10 KOhm, 1/4 W  [resistor_0603]
R23  10 KOhm, 1/4 W  [resistor_0603]

### Blocks framed on the sheet
Battery Voltage Measure: C15 C16 D2 D3 R17 R18 R20
ADC Motor: C14 R16 R19
LED: D4-D6 R21-R23
Output Test: P6

### Ports
ADC_BAT, ADC_MOTOR, OUT_A, OUT_B, TIMER

### Nets
+3.3: D2.2(K) R23.2
+5: R22.2
+VIN: R17.2 R21.2
GND: C14.1 C15.1 C16.1 D3.1(A) D4.1(K) D5.1(K) D6.1(K) P6.4 R19.1 R20.1
NetC6_2: P6.3 R16.1 ; port OUT_A
NetC12_2: P6.1 ; port TIMER
NetC14_2: C14.2 R16.2 R19.2 ; port ADC_MOTOR
NetC15_2: C15.2 C16.2 D2.1(A) D3.2(K) R18.2 ; port ADC_BAT
NetD4_2: D4.2(A) R21.1
NetD5_2: D5.2(A) R22.1
NetD6_2: D6.2(A) R23.1
NetP6_2: P6.2 ; port OUT_B
NetR17_1: R17.1 R18.1 R20.2

### Notes on the sheet
- (near *?#4) Future Automotive Solution Testing - F.A.S.T Lab
- AutonomousVehicle_CurrentMeasure
- Variant:
- Checked by
- Designed by BitterSweet
- (in symbol SDTitleBlock) Title:; Page Contents:; Revision:; Size:; DWG NO; Date:; Sheet; of

### Library data of the parts
C14 C16 = 0106031041050: as C9 on sheet CurrentSense_InputProcessing; ComponentLink2Description: Datasheet; ComponentLink2URL: https://product.tdk.com/system/files/dam/doc/product/capacitor/ceramic/mlcc/catalog/mlcc_automotive_soft_en.pdf?ref_disty=mouser; Operating Temperature: -55 to +125degC; Packaging: Tape and Reel; Mounting Technology: SMT; Size: 0603; Supplier 1 Name: Mouser; Supplier 1 SN: 810-CGA3E3X8R1H104KA; Supplier 1 URL: https://www.mouser.com/ProductDetail/TDK/CGA3E3X8R1H104K080AE?qs=nQSIdc08i%252Bd8g3IRRgU2bw%3D%3D&utm_source=mouser-refine-download&utm_medium=file&utm_campaign=CGA3E3X8R1H104K080AE&utm_content=TDK; Supplier 2 Name: Digi-Key; Supplier 2 SN: 445-173697-2-ND; Supplier 2 URL: https://www.digikey.com/en/products/detail/tdk-corporation/cga3e3x8r1h104k080ae/5809262; Supplier 3 Name: thegioiic; Supplier 3 SN: N/A; Supplier 3 URL: N/Ahttps://www.thegioiic.com/tu-gom-0603-100nf-0-1uf-50v; Value: 100 nF, 50 VDC
C15 = 0106031051016: as C8 on sheet CurrentSense_InputProcessing; ComponentLink2Description: Datasheet; ComponentLink2URL: https://www.mouser.vn/datasheet/2/585/Samsung_MLCC_1837944-1929650.pdf; Operating Temperature: -55 to +125degC; Packaging: Tape and Reel; Mounting Technology: SMT; Size: 0603; Supplier 1 Name: Mouser; Supplier 1 SN: 187-CL10B105KO8NNWC; Supplier 1 URL: https://www.mouser.vn/ProductDetail/Samsung-Electro-Mechanics/CL10B105KO8NNWC?qs=81r%252BiQLm7BT%252BXtc72qn1ug%3D%3D&utm_source=mouser-refine-download&utm_medium=file&utm_campaign=CL10B105KO8NNWC&utm_content=Samsung-Electro-Mechanics; Supplier 2 Name: Digi-Key; Supplier 2 SN: 1276-CL10B105KO8NNWCTR-ND; Supplier 2 URL: https://www.digikey.com/en/products/detail/samsung-electro-mechanics/cl10b105ko8nnwc/16572783; Supplier 3 Name: thegioiic; Supplier 3 SN: N/A; Supplier 3 URL: https://www.thegioiic.com/tu-gom-0603-1uf-16v; Value: 1 uF, 16 VDC
D2 D3 = Diode_Schottky: SS54 SMC Diode Schottky 5A 40V
D4-D6 = 160603BlueClear: WL-SMCW SMT Mono-color Chip LED Waterclear, size 0603, Blue, 3.2V, 140deg; Type: Clear; Color: Blue; Size: 0603; ComponentLink1Description: Datasheet link; ComponentLink1URL: N/A; ComponentLink2Description: Supplier 1 URL; ComponentLink2URL: https://www.mouser.vn/ProductDetail/Wurth-Elektronik/150060BS75003?qs=Li%252BoUPsLEnu8LvIbM48DKA%3D%3D; ComponentLink3Description: Supplier 2 URL; ComponentLink3URL: https://www.digikey.com/en/products/detail/liteon/LTST-C191TBKT/388530; ComponentLink4Description: Supplier 3 URL; ComponentLink4URL: https://www.thegioiic.com/led-xanh-duong-0603-dan-smd-trong-suot; Supplier 1 Name: Mouser; Supplier 1 SN: 710-150060GS75000; Supplier 1 URL: https://www.mouser.vn/ProductDetail/Wurth-Elektronik/150060BS75003?qs=Li%252BoUPsLEnu8LvIbM48DKA%3D%3D; Supplier 2 Name: Digi-Key; Supplier 2 SN: 160-1647-2-ND; Supplier 2 URL: https://www.digikey.com/en/products/detail/liteon/LTST-C191TBKT/388530; Supplier 3 Name: ICDayRoi; Supplier 3 SN: N/A; Supplier 3 URL: https://www.thegioiic.com/led-xanh-duong-0603-dan-smd-trong-suot; Value: Blue, 3.2V
P6 = 61300411121: WR-PHD Pin Header, THT, pitch 2.54mm, Single Row, Vertical, 4p; Manufacturer: Wurth Elektronik; Pin Number: 4; Rated Current: 3A; Working Voltage: 250VAC; Withstanding Voltage: 500VAC; Contact Resistance: 20mOhm; Supply Name 1: Mouser; ComponentLink1Description: Manufacturer; ComponentLink1URL: http://www.we-online.de; ComponentLink2Description: Datasheet; ComponentLink2URL: https://www.we-online.com/catalog/datasheet/61300411121.pdf; Manufacturer Part Number: 61300411121; Published Date: May 2020; Pitch: 2.54mm; Operating Temperature: -40 to +105degC; Mounting Technology: THT; Packaging: Bag; Gender: Pin Header; Row Number: Single; Orientation: Vertical; ComponentLink3Description: Global Supply; ComponentLink3URL: https://www.we-online.com/en/components/products/PHD_2_54_THT_PIN_HEADER_6130XX11121?sq=61300411121#61300411121; ComponentLink4Description: Global Supply; ComponentLink4URL: https://www.mouser.vn/ProductDetail/Wurth-Elektronik/61300411121?qs=PhR8RmCirEYQcLLqXD8rAA%3D%3D; Supplier 1 Name: Mouser; Supplier 1 SN: 710-61300311121; Supplier 1 URL: https://www.mouser.vn/ProductDetail/Wurth-Elektronik/61300311121?qs=PhR8RmCirEYxRWFJzNKsUw%3D%3D; Supplier 2 Name: Digi-Key; Supplier 2 SN: N/A; Supplier 2 URL: N/A; Supplier 3 Name: thegioiic; Supplier 3 SN: N/A; Supplier 3 URL: N/A
R16 R19 = 0006033301: RES, size 0603, 33 Ohm, 1/4 W; Manufacture  Name: OEM; Resistance: 33 KOhm; Rated Power: 1/4 W; Resistance Tolerance: +/-1%; Size: 0603; Mounting Technology: SMT; Supplier 1 Name: Mouser; Supplier 1 SN: 667-ERJ-UP3F33R0V; Supplier 2 Name: Digi-Key; Supplier 2 SN: 10-ERJ-UP3F33R0VTR-ND 10-ERJ-UP3F33R0VCT-ND 10-ERJ-UP3F33R0VDKR-ND; Supplier 1 URL: https://www.mouser.vn/ProductDetail/Panasonic/ERJ-UP3F33R0V?qs=sGAEpiMZZMvdGkrng054twq3eZrCFN89SIaxCOiI%2FLhwYCTxSQzpaA%3D%3D; Supplier 3 Name: thegioiic; Supplier 3 SN: N/A; Supplier 3 URL: https://www.thegioiic.com/dien-tro-33-kohm-0603-1-; Manufacture  SN: OEM; Value: 33 KOhm, 1/4 W; ComponentLink1Description: Datasheet link; ComponentLink1URL: https://api.pim.na.industrial.panasonic.com/file_stream/main/fileversion/4484; ComponentLink2Description: Supplier 1 URL; ComponentLink2URL: N/A; ComponentLink3Description: Supplier 2 URL; ComponentLink3URL: https://www.digikey.com/en/products/detail/panasonic-electronic-components/ERJ-UP3F33R0V/12092441; ComponentLink4Description: Supplier 3 URL; ComponentLink4URL: N/A; Supplier 2 URL: https://www.digikey.com/en/products/detail/panasonic-electronic-components/ERJ-UP3F33R0V/12092441
R17 R21-R23 = 0006031031: as R6 on sheet CurrentSense_InputProcessing; Size: 0603; Mounting Technology: SMT; Supplier 1 Name: Mouser; Supplier 1 SN: 755-ESR03EZPF1002; Supplier 2 Name: Digi-Key; Supplier 2 SN: RHM10KADTR-ND RHM10KADCT-ND RHM10KADDKR-ND; Supplier 1 URL: https://www.mouser.vn/ProductDetail/ROHM-Semiconductor/ESR03EZPF1002?qs=sGAEpiMZZMvdGkrng054t67Efho1F8r6CDeAsqwFse8%3D; Supplier 3 Name: thegioiic; Supplier 3 SN: N/A; Supplier 3 URL: https://www.thegioiic.com/dien-tro-10-kohm-0603-1-; Manufacture  SN: OEM; Value: 10 KOhm, 1/4 W; ComponentLink1Description: Datasheet link; ComponentLink1URL: https://fscdn.rohm.com/en/products/databook/datasheet/passive/resistor/chip_resistor/esr-e.pdf; ComponentLink2Description: Supplier 1 URL; ComponentLink2URL: N/A; ComponentLink3Description: Supplier 2 URL; ComponentLink3URL: https://www.digikey.com/en/products/detail/rohm-semiconductor/ESR03EZPF1002/1983429; ComponentLink4Description: Supplier 3 URL; ComponentLink4URL: N/A; Supplier 2 URL: https://www.digikey.com/en/products/detail/rohm-semiconductor/ESR03EZPF1002/1983429
R18 = 0006031001: RES, size 0603, 10 Ohm, 1/4 W; Manufacture  Name: YAGEO; Manufacture  SN: SR0603FR-7T10RL; Resistance: 10 Ohm; Rated Power: 1/4 W; Resistance Tolerance: +/-1%; Size: 0603; Mounting Technology: SMT; Supplier 1 Name: Mouser; Supplier 1 SN: 603-SR0603FR-7T10RL; Supplier 2 Name: Digi-Key; Supplier 2 SN: YAG5824TR-ND YAG5824CT-ND YAG5824DKR-ND; Supplier 1 URL: https://www.mouser.vn/ProductDetail/YAGEO/SR0603FR-7T10RL?qs=sGAEpiMZZMvdGkrng054tz1y1XEHv7sNLVh8FRa6mVfbhGJwfIIhGg%3D%3D; Supplier 3 Name: thegioiic; Supplier 3 SN: N/A; Supplier 3 URL: https://www.thegioiic.com/dien-tro-0-ohm-0603-1-; Value: 10 Ohm, 1/4 W; ComponentLink1Description: Datasheet link; ComponentLink1URL: https://www.yageo.com/upload/media/product/productsearch/datasheet/rchip/PYu-SR_20105_RoHS_L_10.pdf; ComponentLink2Description: Supplier 1 URL; ComponentLink2URL: N/A; ComponentLink3Description: Supplier 2 URL; ComponentLink3URL: https://www.digikey.com/en/products/detail/yageo/SR0603FR-7T10RL/9373098; ComponentLink4Description: Supplier 3 URL; ComponentLink4URL: N/A; Supplier 2 URL: https://www.digikey.com/en/products/detail/yageo/SR0603FR-7T10RL/9373098
R20 = 0006033321: RES, size 0603, 3.3 KOhm, 1/4 W; Manufacture  Name: OEM; Rated Power: 1/4 W; Resistance Tolerance: +/-1%; Resistance: 3.3 KOhm; Size: 0603; Mounting Technology: SMT; Supplier 1 Name: Mouser; Supplier 1 SN: 667-ERJ-PA3F3301V; Supplier 2 Name: Digi-Key; Supplier 2 SN: 10-ERJ-UP3F3301VTR-ND 10-ERJ-UP3F3301VCT-ND 10-ERJ-UP3F3301VDKR-ND; Supplier 1 URL: https://www.mouser.vn/ProductDetail/Panasonic/ERJ-PA3F3301V?qs=sGAEpiMZZMvdGkrng054t6%2FAfIpq60YDpB2wwO%252BBqIBQy72ynM%2FI9Q%3D%3D; Supplier 3 Name: thegioiic; Supplier 3 SN: N/A; Supplier 3 URL: https://www.thegioiic.com/dien-tro-3-3-kohm-0603-1-; Manufacture  SN: OEM; Value: 3.3 KOhm, 1/4 W; ComponentLink1Description: Datasheet link; ComponentLink1URL: https://api.pim.na.industrial.panasonic.com/file_stream/main/fileversion/4484; ComponentLink2Description: Supplier 1 URL; ComponentLink2URL: N/A; ComponentLink3Description: Supplier 2 URL; ComponentLink3URL: https://www.digikey.com/en/products/detail/panasonic-electronic-components/ERJ-UP3F3301V/12093093; ComponentLink4Description: Supplier 3 URL; ComponentLink4URL: N/A; Supplier 2 URL: https://www.digikey.com/en/products/detail/panasonic-electronic-components/ERJ-UP3F3301V/12093093

## Nets that join several sheets
+3.3: CurrentSense_PowerDistribution (C4.2 TP3.1 U2.2 U2.4), CurrentSense_InputProcessing (R6.2), CurrentSense_ADCVoltage (D2.2 R23.2)
+5: CurrentSense_PowerDistribution (6 pins), CurrentSense_InputProcessing (11 pins), CurrentSense_ADCVoltage (R22.2)
+VIN: CurrentSense_PowerDistribution (D1.2 D7.1 F1.0 TP1.1), CurrentSense_ADCVoltage (R17.2 R21.2)
GND: CurrentSense_PowerDistribution (12 pins), CurrentSense_InputProcessing (13 pins), CurrentSense_ADCVoltage (10 pins)
NetC5_1: CurrentSense_PowerDistribution (C5.1 R3.2), CurrentSense_InputProcessing (U3.1)
NetC5_2: CurrentSense_PowerDistribution (C5.2 R1.2), CurrentSense_InputProcessing (U3.8)
NetC6_2: CurrentSense_InputProcessing (5 pins), CurrentSense_ADCVoltage (P6.3 R16.1)
NetC12_2: CurrentSense_PowerDistribution (P1.2), CurrentSense_InputProcessing (C12.2 R6.1 R9.2 U5.4), CurrentSense_ADCVoltage (P6.1)
NetC14_2: CurrentSense_PowerDistribution (P2.2), CurrentSense_ADCVoltage (C14.2 R16.2 R19.2)
NetC15_2: CurrentSense_PowerDistribution (P3.1), CurrentSense_ADCVoltage (5 pins)
NetP6_2: CurrentSense_InputProcessing (R8.2 U4.7 U5.3), CurrentSense_ADCVoltage (P6.2)